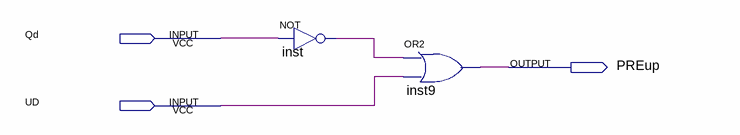
[diagram p0: schematic sheet]
// Quartus schematic PREup.bdf as structural Verilog: 2 symbols, 3 pins
module PREup (
  input  Qd,
  input  UD,
  output PREup
);

  wire inst_out;

  not inst (inst_out, Qd);
  or inst9 (PREup, inst_out, UD);
endmodule
